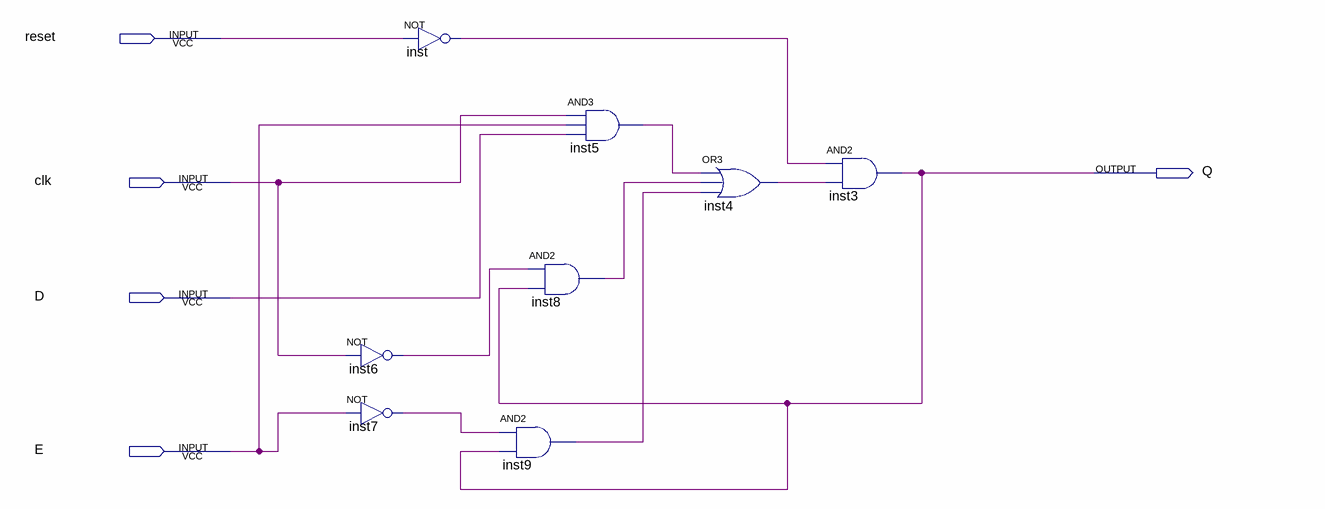
[diagram p0: schematic sheet]
// Quartus schematic DESwitch.bdf as structural Verilog: 8 symbols, 5 pins
module DESwitch (
  input  reset,
  input  clk,
  input  D,
  input  E,
  output Q
);

  wire inst4_out, inst5_out, inst6_out, inst7_out, inst8_out, inst9_out, inst_out;

  not inst (inst_out, reset);
  not inst6 (inst6_out, clk);
  not inst7 (inst7_out, E);
  and inst8 (inst8_out, inst6_out, Q);
  and inst9 (inst9_out, inst7_out, Q);
  and inst5 (inst5_out, clk, E, D);
  or inst4 (inst4_out, inst5_out, inst8_out, inst9_out);
  and inst3 (Q, inst_out, inst4_out);
endmodule
